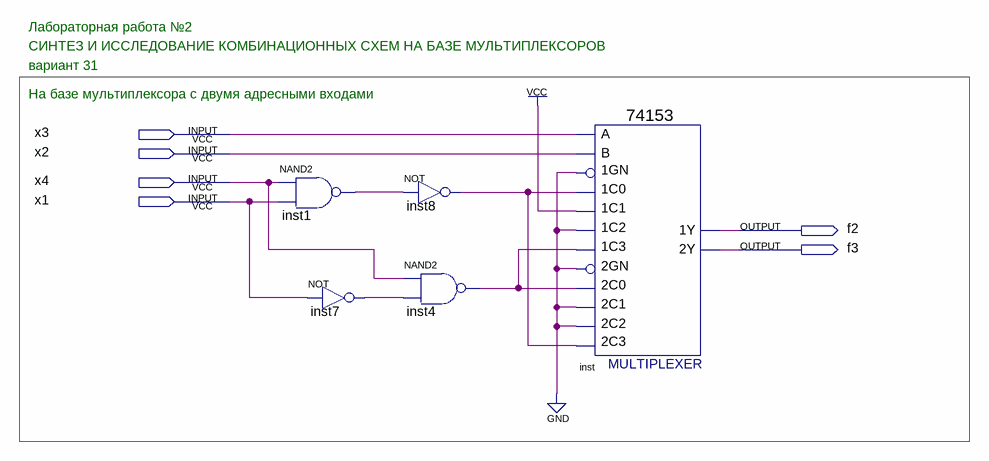
[diagram p0: schematic sheet]
// Quartus schematic MUX_with_2_adress_input.bdf as structural Verilog: 5 symbols, 6 pins
module MUX_with_2_adress_input (
  input  x3,
  input  x2,
  input  x4,
  input  x1,
  output f2,
  output f3
);

  wire inst1_out, inst4_out, inst7_out, inst8_out;

  nand inst1 (inst1_out, x4, x1);
  not inst7 (inst7_out, x1);
  not inst8 (inst8_out, inst1_out);
  nand inst4 (inst4_out, x4, inst7_out);
  \74153  inst (
    .\1C1 (1'b1), .\1GN (1'b0), .\1C0 (inst8_out), .\2C0 (inst4_out), .\2GN (1'b0), .\2C2 (1'b0),
    .\1C2 (1'b0), .\1C3 (inst4_out), .B(x2), .A(x3), .\2C1 (1'b0), .\2C3 (inst8_out), .\1Y (f2), .\2Y (f3));

  // Notes on the sheet:
  //   Лабораторная работа №2
  //   СИНТЕЗ И ИССЛЕДОВАНИЕ КОМБИНАЦИОННЫХ СХЕМ НА БАЗЕ МУЛЬТИПЛЕКСОРОВ
  //   вариант 31
  //   На базе мультиплексора с двумя адресными входами
endmodule
